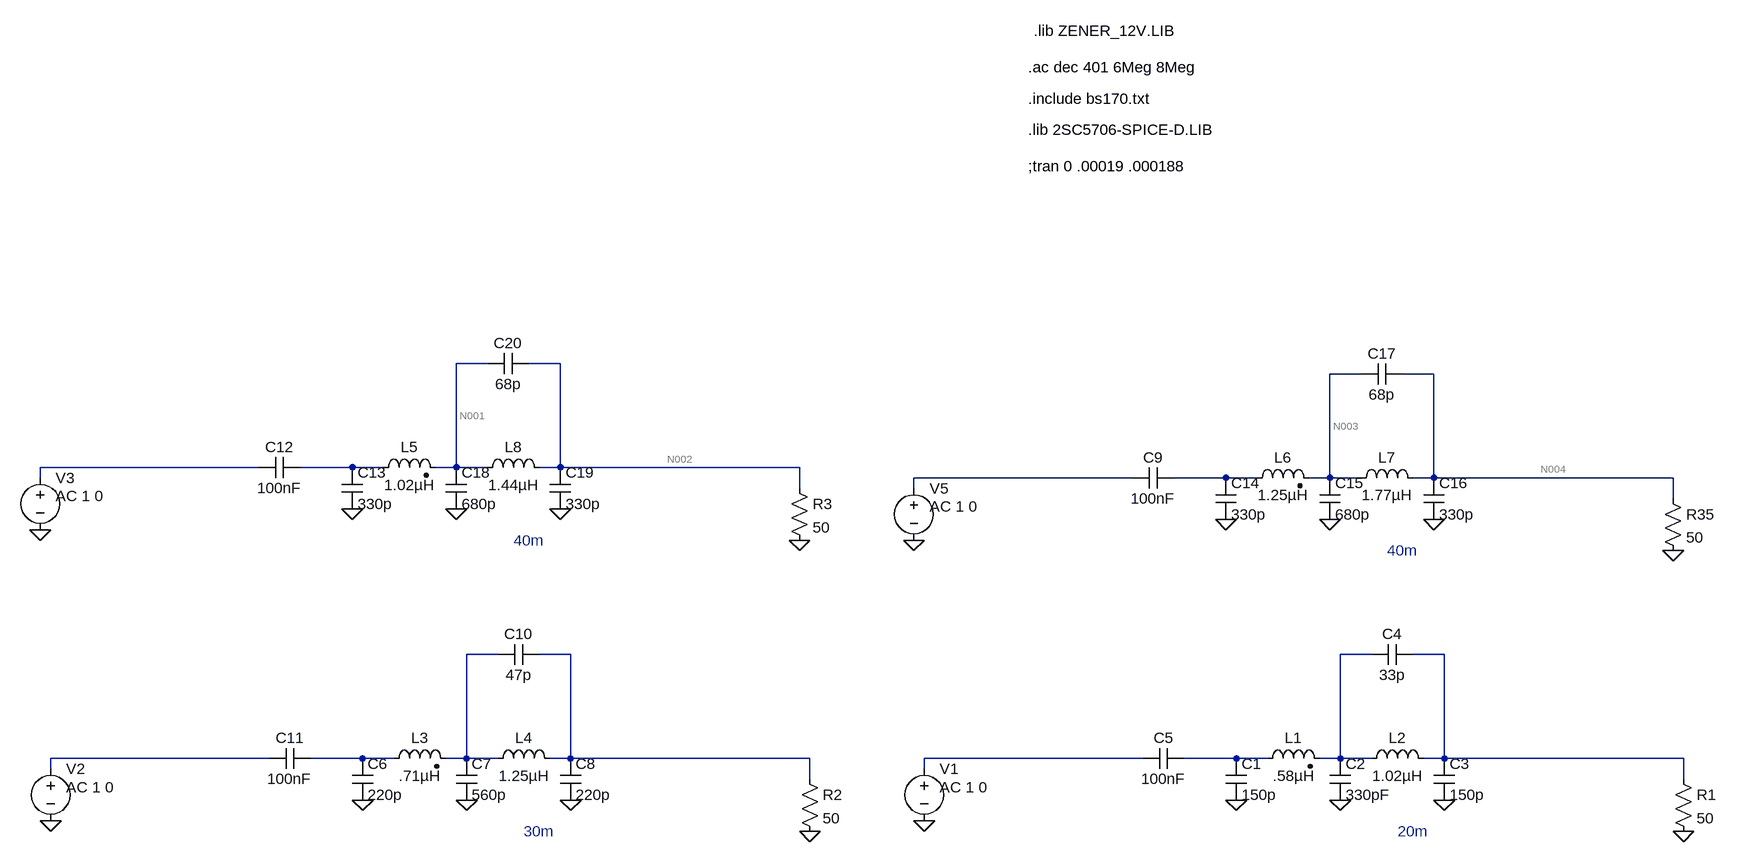
[diagram p0: schematic Harmonic Trap Impedance.asc]
Harmonic Trap Impedance.asc, the LTspice schematic file:
Version 4
SHEET 1 3764 1240
WIRE -4320 -2928 -4368 -2928
WIRE -4208 -2928 -4256 -2928
WIRE -2976 -2912 -3024 -2912
WIRE -2864 -2912 -2912 -2912
WIRE -4672 -2768 -5008 -2768
WIRE -4528 -2768 -4608 -2768
WIRE -4480 -2768 -4528 -2768
WIRE -4368 -2768 -4368 -2928
WIRE -4368 -2768 -4400 -2768
WIRE -4320 -2768 -4368 -2768
WIRE -4208 -2768 -4208 -2928
WIRE -4208 -2768 -4240 -2768
WIRE -3840 -2768 -4208 -2768
WIRE -5008 -2752 -5008 -2768
WIRE -3328 -2752 -3664 -2752
WIRE -3184 -2752 -3264 -2752
WIRE -3136 -2752 -3184 -2752
WIRE -3024 -2752 -3024 -2912
WIRE -3024 -2752 -3056 -2752
WIRE -2976 -2752 -3024 -2752
WIRE -2864 -2752 -2864 -2912
WIRE -2864 -2752 -2896 -2752
WIRE -2496 -2752 -2864 -2752
WIRE -3840 -2736 -3840 -2768
WIRE -3664 -2736 -3664 -2752
WIRE -2496 -2720 -2496 -2752
WIRE -4304 -2480 -4352 -2480
WIRE -4192 -2480 -4240 -2480
WIRE -2960 -2480 -3008 -2480
WIRE -2848 -2480 -2896 -2480
WIRE -4656 -2320 -4992 -2320
WIRE -4512 -2320 -4592 -2320
WIRE -4464 -2320 -4512 -2320
WIRE -4352 -2320 -4352 -2480
WIRE -4352 -2320 -4384 -2320
WIRE -4304 -2320 -4352 -2320
WIRE -4192 -2320 -4192 -2480
WIRE -4192 -2320 -4224 -2320
WIRE -3824 -2320 -4192 -2320
WIRE -3312 -2320 -3648 -2320
WIRE -3168 -2320 -3248 -2320
WIRE -3120 -2320 -3168 -2320
WIRE -3008 -2320 -3008 -2480
WIRE -3008 -2320 -3040 -2320
WIRE -2960 -2320 -3008 -2320
WIRE -2848 -2320 -2848 -2480
WIRE -2848 -2320 -2880 -2320
WIRE -2480 -2320 -2848 -2320
WIRE -4992 -2304 -4992 -2320
WIRE -3648 -2304 -3648 -2320
WIRE -3824 -2288 -3824 -2320
WIRE -2480 -2288 -2480 -2320
FLAG -2496 -2640 0
FLAG -3184 -2688 0
FLAG -3024 -2688 0
FLAG -2864 -2688 0
FLAG -3664 -2656 0
FLAG -2480 -2208 0
FLAG -3168 -2256 0
FLAG -3008 -2256 0
FLAG -2848 -2256 0
FLAG -3648 -2224 0
FLAG -3824 -2208 0
FLAG -4512 -2256 0
FLAG -4352 -2256 0
FLAG -4192 -2256 0
FLAG -4992 -2224 0
FLAG -3840 -2656 0
FLAG -4528 -2704 0
FLAG -4368 -2704 0
FLAG -4208 -2704 0
FLAG -5008 -2672 0
SYMBOL cap -3264 -2768 R90
WINDOW 0 0 32 VBottom 2
WINDOW 3 32 32 VTop 2
SYMATTR InstName C9
SYMATTR Value 100nF
SYMBOL res -2512 -2736 R0
SYMATTR InstName R35
SYMATTR Value 50
SYMBOL cap -3200 -2752 R0
SYMATTR InstName C14
SYMATTR Value 330p
SYMBOL cap -3040 -2752 R0
SYMATTR InstName C15
SYMATTR Value 680p
SYMBOL cap -2880 -2752 R0
SYMATTR InstName C16
SYMATTR Value 330p
SYMBOL ind2 -3152 -2736 R270
WINDOW 0 32 56 VTop 2
WINDOW 3 5 56 VBottom 2
SYMATTR InstName L6
SYMATTR Value 1.25µH
SYMATTR Type ind
SYMBOL ind -2992 -2736 R270
WINDOW 0 32 56 VTop 2
WINDOW 3 5 56 VBottom 2
SYMATTR InstName L7
SYMATTR Value 1.77µH
SYMBOL cap -2912 -2928 R90
WINDOW 0 0 32 VBottom 2
WINDOW 3 32 32 VTop 2
SYMATTR InstName C17
SYMATTR Value 68p
SYMBOL voltage -3664 -2752 R0
WINDOW 123 24 44 Left 2
WINDOW 39 0 0 Left 0
SYMATTR Value2 AC 1 0
SYMATTR InstName V5
SYMATTR Value ""
SYMBOL res -2496 -2304 R0
SYMATTR InstName R1
SYMATTR Value 50
SYMBOL cap -3184 -2320 R0
SYMATTR InstName C1
SYMATTR Value 150p
SYMBOL cap -3024 -2320 R0
SYMATTR InstName C2
SYMATTR Value 330pF
SYMBOL cap -2864 -2320 R0
SYMATTR InstName C3
SYMATTR Value 150p
SYMBOL ind2 -3136 -2304 R270
WINDOW 0 32 56 VTop 2
WINDOW 3 5 56 VBottom 2
SYMATTR InstName L1
SYMATTR Value .58µH
SYMATTR Type ind
SYMBOL ind -2976 -2304 R270
WINDOW 0 32 56 VTop 2
WINDOW 3 5 56 VBottom 2
SYMATTR InstName L2
SYMATTR Value 1.02µH
SYMBOL cap -2896 -2496 R90
WINDOW 0 0 32 VBottom 2
WINDOW 3 32 32 VTop 2
SYMATTR InstName C4
SYMATTR Value 33p
SYMBOL cap -3248 -2336 R90
WINDOW 0 0 32 VBottom 2
WINDOW 3 32 32 VTop 2
SYMATTR InstName C5
SYMATTR Value 100nF
SYMBOL voltage -3648 -2320 R0
WINDOW 123 24 44 Left 2
WINDOW 39 0 0 Left 0
SYMATTR Value2 AC 1 0
SYMATTR InstName V1
SYMATTR Value ""
SYMBOL res -3840 -2304 R0
SYMATTR InstName R2
SYMATTR Value 50
SYMBOL cap -4528 -2320 R0
SYMATTR InstName C6
SYMATTR Value 220p
SYMBOL cap -4368 -2320 R0
SYMATTR InstName C7
SYMATTR Value 560p
SYMBOL cap -4208 -2320 R0
SYMATTR InstName C8
SYMATTR Value 220p
SYMBOL ind2 -4480 -2304 R270
WINDOW 0 32 56 VTop 2
WINDOW 3 5 56 VBottom 2
SYMATTR InstName L3
SYMATTR Value .71µH
SYMATTR Type ind
SYMBOL ind -4320 -2304 R270
WINDOW 0 32 56 VTop 2
WINDOW 3 5 56 VBottom 2
SYMATTR InstName L4
SYMATTR Value 1.25µH
SYMBOL cap -4240 -2496 R90
WINDOW 0 0 32 VBottom 2
WINDOW 3 32 32 VTop 2
SYMATTR InstName C10
SYMATTR Value 47p
SYMBOL cap -4592 -2336 R90
WINDOW 0 0 32 VBottom 2
WINDOW 3 32 32 VTop 2
SYMATTR InstName C11
SYMATTR Value 100nF
SYMBOL voltage -4992 -2320 R0
WINDOW 123 24 44 Left 2
WINDOW 39 0 0 Left 0
SYMATTR Value2 AC 1 0
SYMATTR InstName V2
SYMATTR Value ""
SYMBOL cap -4608 -2784 R90
WINDOW 0 0 32 VBottom 2
WINDOW 3 32 32 VTop 2
SYMATTR InstName C12
SYMATTR Value 100nF
SYMBOL res -3856 -2752 R0
SYMATTR InstName R3
SYMATTR Value 50
SYMBOL cap -4544 -2768 R0
SYMATTR InstName C13
SYMATTR Value 330p
SYMBOL cap -4384 -2768 R0
SYMATTR InstName C18
SYMATTR Value 680p
SYMBOL cap -4224 -2768 R0
SYMATTR InstName C19
SYMATTR Value 330p
SYMBOL ind2 -4496 -2752 R270
WINDOW 0 32 56 VTop 2
WINDOW 3 5 56 VBottom 2
SYMATTR InstName L5
SYMATTR Value 1.02µH
SYMATTR Type ind
SYMBOL ind -4336 -2752 R270
WINDOW 0 32 56 VTop 2
WINDOW 3 5 56 VBottom 2
SYMATTR InstName L8
SYMATTR Value 1.44µH
SYMBOL cap -4256 -2944 R90
WINDOW 0 0 32 VBottom 2
WINDOW 3 32 32 VTop 2
SYMATTR InstName C20
SYMATTR Value 68p
SYMBOL voltage -5008 -2768 R0
WINDOW 123 24 44 Left 2
WINDOW 39 0 0 Left 0
SYMATTR Value2 AC 1 0
SYMATTR InstName V3
SYMATTR Value ""
TEXT -3488 -3288 Left 2 !.lib 2SC5706-SPICE-D.LIB
TEXT -3488 -3232 Left 2 !;tran 0 .00019 .000188
TEXT -3488 -3336 Left 2 !.include bs170.txt
TEXT -3480 -3440 Left 2 !.lib ZENER_12V.LIB
TEXT -2936 -2640 Left 2 ;40m
TEXT -3488 -3384 Left 2 !.ac dec 401 6Meg 8Meg
TEXT -2920 -2208 Left 2 ;20m
TEXT -4264 -2208 Left 2 ;30m
TEXT -4280 -2656 Left 2 ;40m

The netlist it stands for:
* Harmonic Trap Impedance.asc
C9 N008 N007 100nF
R35 N004 0 50
C14 N008 0 330p
C15 N003 0 680p
C16 N004 0 330p
L6 N008 N003 1.25µH
L7 N003 N004 1.77µH
C17 N004 N003 68p
V5 N007 0 AC 1 0
R1 N012 0 50
C1 N016 0 150p
C2 N011 0 330pF
C3 N012 0 150p
L1 N016 N011 .58µH
L2 N011 N012 1.02µH
C4 N012 N011 33p
C5 N016 N015 100nF
V1 N015 0 AC 1 0
R2 N010 0 50
C6 N014 0 220p
C7 N009 0 560p
C8 N010 0 220p
L3 N014 N009 .71µH
L4 N009 N010 1.25µH
C10 N010 N009 47p
C11 N014 N013 100nF
V2 N013 0 AC 1 0
C12 N006 N005 100nF
R3 N002 0 50
C13 N006 0 330p
C18 N001 0 680p
C19 N002 0 330p
L5 N006 N001 1.02µH
L8 N001 N002 1.44µH
C20 N002 N001 68p
V3 N005 0 AC 1 0
.lib 2SC5706-SPICE-D.LIB
;tran 0 .00019 .000188
.include bs170.txt
.lib ZENER_12V.LIB
* 40m
.ac dec 401 6Meg 8Meg
* 20m
* 30m
* 40m
.backanno
.end

* Results of the author's LTspice run, read from the files saved beside the schematic
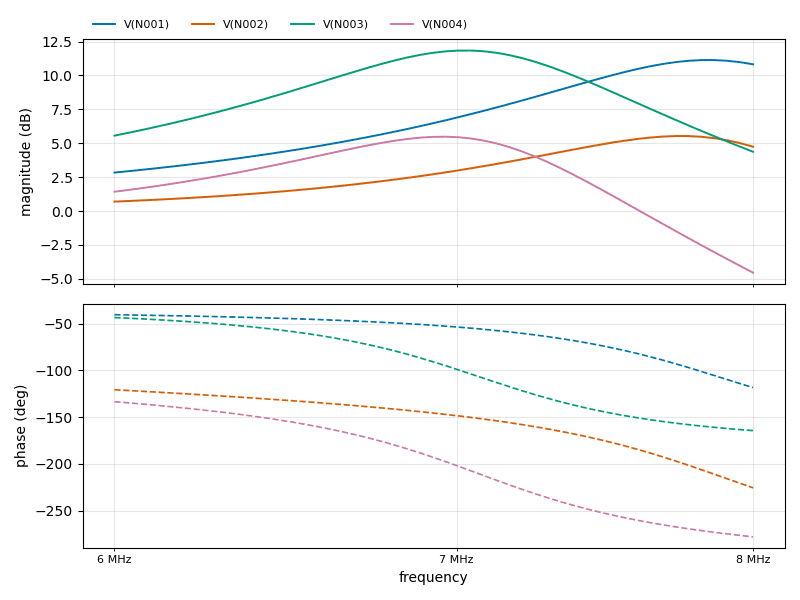
[diagram p1: AC Analysis of Harmonic Trap Impedance.asc, plotted from the saved traces]
* AC Analysis, 1 run:
*   V(N001): 2.84 dB at 6 MHz, 10.82 dB at 8 MHz, peak 11.14 dB at 7.859 MHz, 3 dB below the peak at 7.205 MHz
*   V(N002): 0.70 dB at 6 MHz, 4.74 dB at 8 MHz, peak 5.53 dB at 7.725 MHz, 3 dB below the peak at 6.869 MHz
*   V(N003): 5.56 dB at 6 MHz, 4.37 dB at 8 MHz, peak 11.84 dB at 7.047 MHz, 3 dB below the peak at 6.495 MHz and 7.503 MHz
*   V(N004): 1.43 dB at 6 MHz, -4.54 dB at 8 MHz, peak 5.49 dB at 6.966 MHz, 3 dB below the peak at 6.264 MHz and 7.396 MHz